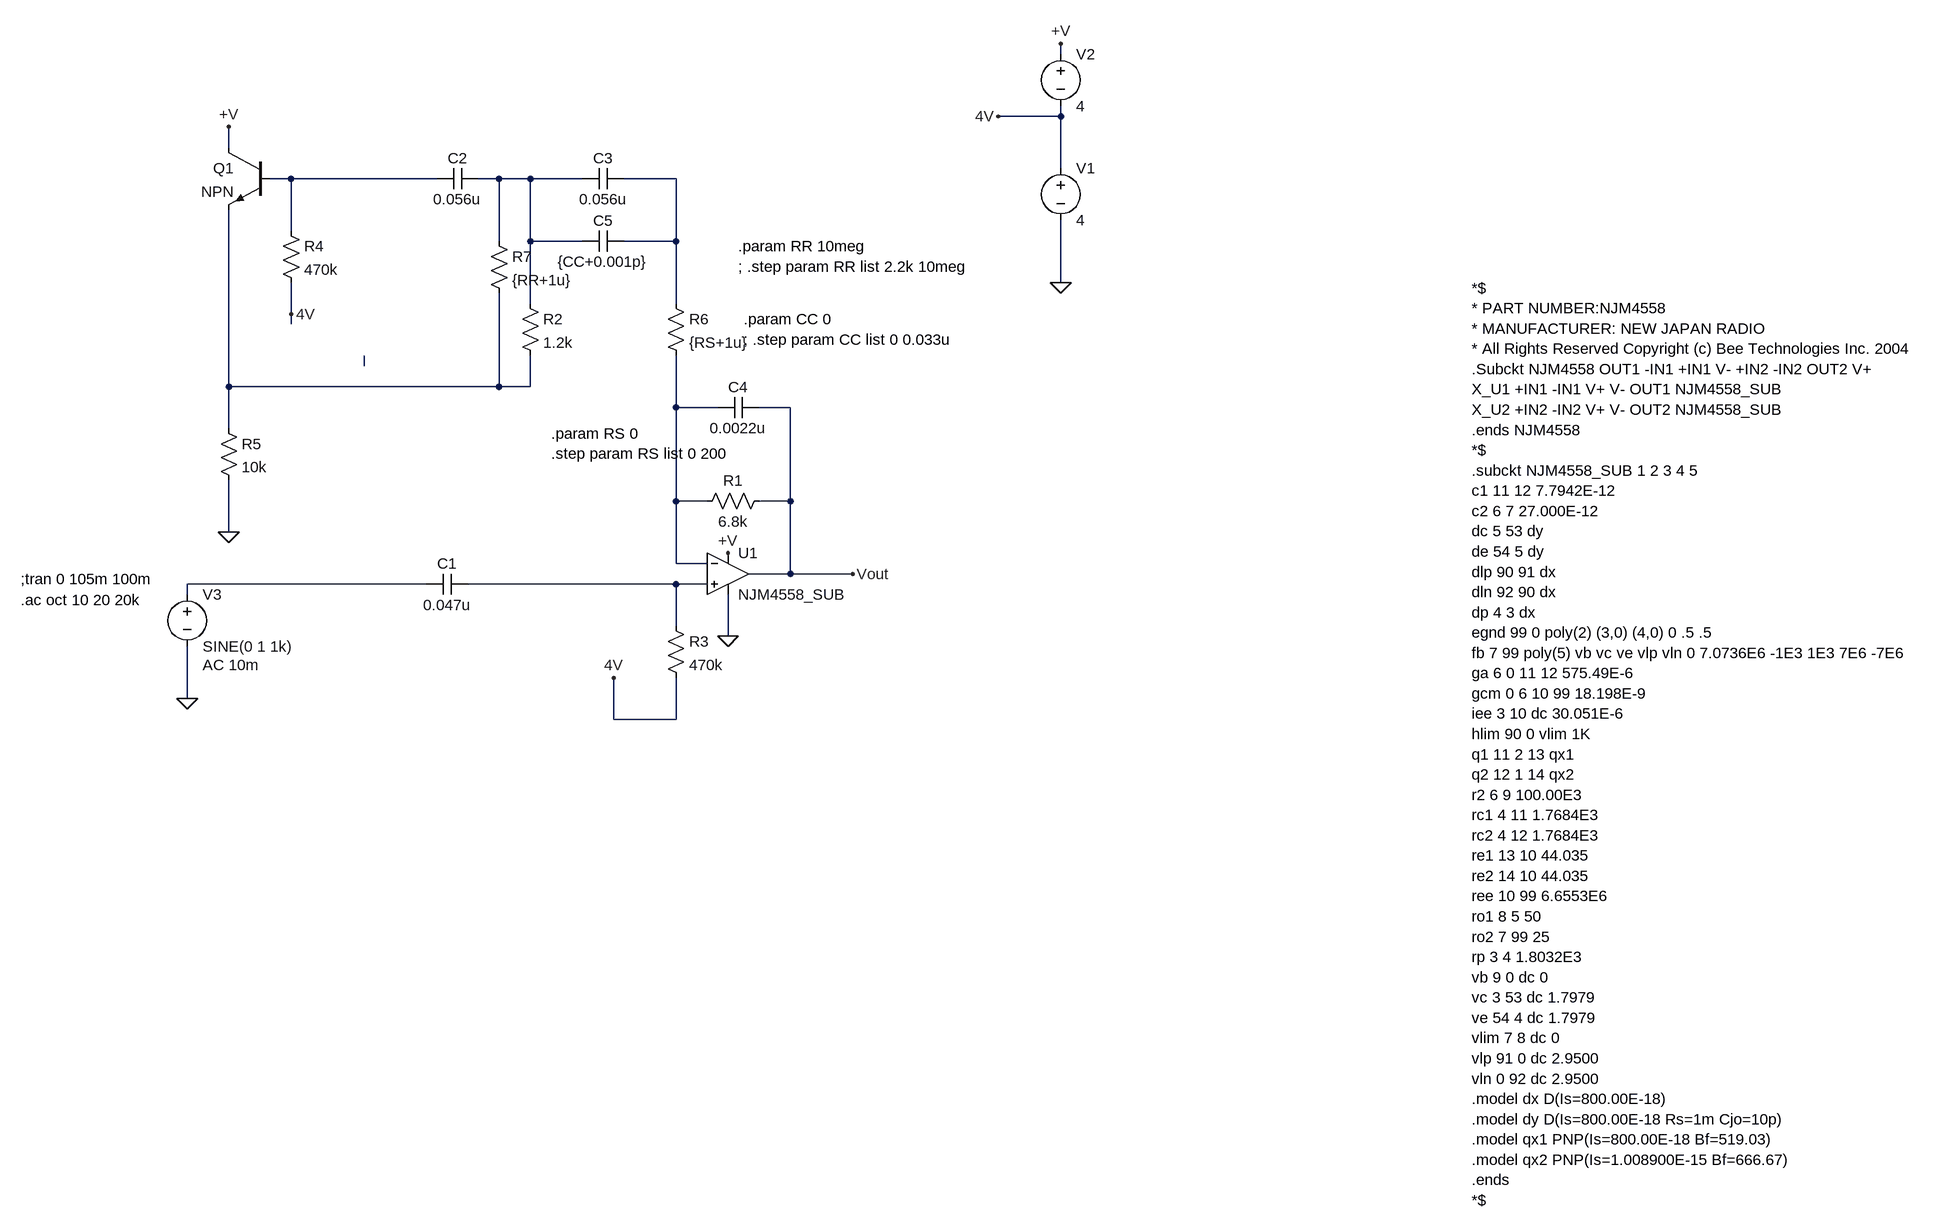
[diagram p0: schematic SimL_LowBoost.asc]
SimL_LowBoost.asc, the LTspice schematic file:
Version 4
SHEET 1 2008 1608
WIRE 560 -160 560 -176
WIRE 560 -64 560 -80
WIRE 560 -64 464 -64
WIRE -720 -16 -720 -48
WIRE 560 16 560 -64
WIRE -624 32 -656 32
WIRE -400 32 -624 32
WIRE -304 32 -336 32
WIRE -256 32 -304 32
WIRE -176 32 -256 32
WIRE -32 32 -112 32
WIRE -624 112 -624 32
WIRE -304 128 -304 32
WIRE -256 128 -256 32
WIRE -176 128 -256 128
WIRE -32 128 -32 32
WIRE -32 128 -112 128
WIRE 560 192 560 96
WIRE -256 224 -256 128
WIRE -32 224 -32 128
WIRE -624 240 -624 192
WIRE -624 256 -624 240
WIRE -512 320 -512 304
WIRE -720 352 -720 80
WIRE -304 352 -304 208
WIRE -304 352 -720 352
WIRE -256 352 -256 304
WIRE -256 352 -304 352
WIRE -32 384 -32 304
WIRE 32 384 -32 384
WIRE 144 384 96 384
WIRE -720 416 -720 352
WIRE -32 528 -32 384
WIRE 16 528 -32 528
WIRE 144 528 144 384
WIRE 144 528 96 528
WIRE -720 576 -720 496
WIRE -32 624 -32 528
WIRE 16 624 -32 624
WIRE 144 640 144 528
WIRE 144 640 80 640
WIRE 240 640 144 640
WIRE -416 656 -784 656
WIRE -32 656 -352 656
WIRE 16 656 -32 656
WIRE -784 672 -784 656
WIRE -32 720 -32 656
WIRE 48 736 48 672
WIRE -784 832 -784 752
WIRE -128 864 -128 800
WIRE -32 864 -32 800
WIRE -32 864 -128 864
FLAG -784 832 0
FLAG 560 192 0
FLAG 560 -176 +V
FLAG 48 608 +V
FLAG 464 -64 4V
FLAG -128 800 4V
FLAG -720 576 0
FLAG -720 -48 +V
FLAG 240 640 Vout
FLAG -624 240 4V
FLAG 48 736 0
SYMBOL Opamps\\opamp2 48 576 R0
SYMATTR InstName U1
SYMATTR Value NJM4558_SUB
SYMBOL voltage 560 0 R0
WINDOW 123 0 0 Left 2
WINDOW 39 0 0 Left 2
SYMATTR InstName V1
SYMATTR Value 4
SYMBOL voltage 560 -176 R0
WINDOW 123 0 0 Left 2
WINDOW 39 0 0 Left 2
SYMATTR InstName V2
SYMATTR Value 4
SYMBOL voltage -784 656 R0
WINDOW 123 24 124 Left 2
WINDOW 39 0 0 Left 2
SYMATTR Value2 AC 10m
SYMATTR InstName V3
SYMATTR Value SINE(0 1 1k)
SYMBOL res 112 512 R90
WINDOW 0 0 56 VBottom 2
WINDOW 3 32 56 VTop 2
SYMATTR InstName R1
SYMATTR Value 6.8k
SYMBOL cap -352 640 R90
WINDOW 0 0 32 VBottom 2
WINDOW 3 32 32 VTop 2
SYMATTR InstName C1
SYMATTR Value 0.047u
SYMBOL res -48 704 R0
SYMATTR InstName R3
SYMATTR Value 470k
SYMBOL npn -656 -16 M0
SYMATTR InstName Q1
SYMBOL cap -336 16 R90
WINDOW 0 0 32 VBottom 2
WINDOW 3 32 32 VTop 2
SYMATTR InstName C2
SYMATTR Value 0.056u
SYMBOL res -272 208 R0
SYMATTR InstName R2
SYMATTR Value 1.2k
SYMBOL res -640 96 R0
SYMATTR InstName R4
SYMATTR Value 470k
SYMBOL res -736 400 R0
SYMATTR InstName R5
SYMATTR Value 10k
SYMBOL cap 96 368 R90
WINDOW 0 0 32 VBottom 2
WINDOW 3 32 32 VTop 2
SYMATTR InstName C4
SYMATTR Value 0.0022u
SYMBOL cap -112 16 R90
WINDOW 0 0 32 VBottom 2
WINDOW 3 32 32 VTop 2
SYMATTR InstName C3
SYMATTR Value 0.056u
SYMBOL res -320 112 R0
SYMATTR InstName R7
SYMATTR Value {RR+1u}
SYMBOL cap -112 112 R90
WINDOW 0 0 32 VBottom 2
WINDOW 3 32 32 VTop 2
SYMATTR InstName C5
SYMATTR Value {CC+0.001p}
SYMBOL res -48 208 R0
SYMATTR InstName R6
SYMATTR Value {RS+1u}
TEXT 1192 200 Left 2 !*$\n* PART NUMBER:NJM4558\n* MANUFACTURER: NEW JAPAN RADIO\n* All Rights Reserved Copyright (c) Bee Technologies Inc. 2004\n.Subckt NJM4558 OUT1 -IN1 +IN1 V- +IN2 -IN2 OUT2 V+\nX_U1 +IN1 -IN1 V+ V- OUT1 NJM4558_SUB\nX_U2 +IN2 -IN2 V+ V- OUT2 NJM4558_SUB\n.ends NJM4558\n*$\n.subckt NJM4558_SUB 1 2 3 4 5\nc1 11 12 7.7942E-12\nc2 6 7 27.000E-12\ndc 5 53 dy\nde 54 5 dy\ndlp 90 91 dx\ndln 92 90 dx\ndp 4 3 dx\negnd 99 0 poly(2) (3,0) (4,0) 0 .5 .5\nfb 7 99 poly(5) vb vc ve vlp vln 0 7.0736E6 -1E3 1E3 7E6 -7E6\nga 6 0 11 12 575.49E-6\ngcm 0 6 10 99 18.198E-9\niee 3 10 dc 30.051E-6\nhlim 90 0 vlim 1K\nq1 11 2 13 qx1\nq2 12 1 14 qx2\nr2 6 9 100.00E3\nrc1 4 11 1.7684E3\nrc2 4 12 1.7684E3\nre1 13 10 44.035\nre2 14 10 44.035\nree 10 99 6.6553E6\nro1 8 5 50\nro2 7 99 25\nrp 3 4 1.8032E3\nvb 9 0 dc 0\nvc 3 53 dc 1.7979\nve 54 4 dc 1.7979\nvlim 7 8 dc 0\nvlp 91 0 dc 2.9500\nvln 0 92 dc 2.9500\n.model dx D(Is=800.00E-18)\n.model dy D(Is=800.00E-18 Rs=1m Cjo=10p)\n.model qx1 PNP(Is=800.00E-18 Bf=519.03)\n.model qx2 PNP(Is=1.008900E-15 Bf=666.67)\n.ends\n*$
TEXT -1040 680 Left 2 !.ac oct 10 20 20k
TEXT -1040 648 Left 2 !;tran 0 105m 100m
TEXT 64 136 Left 2 !.param RR 10meg\n; .step param RR list 2.2k 10meg
TEXT 72 248 Left 2 !.param CC 0\n; .step param CC list 0 0.033u
TEXT -224 424 Left 2 !.param RS 0\n.step param RS list 0 200

The netlist it stands for:
* SimL_LowBoost.asc
XU1 N008 N006 +V 0 Vout NJM4558_SUB  ; pins In+ In- V+ V- OUT
V1 4V 0 4
V2 +V 4V 4
V3 N007 0 SINE(0 1 1k) AC 10m
R1 Vout N006 6.8k
C1 N008 N007 0.047u
R3 N008 4V 470k
Q1 +V N001 N005 0 NPN
C2 N002 N001 0.056u
R2 N002 N005 1.2k
R4 N001 4V 470k
R5 N005 0 10k
C4 Vout N006 0.0022u
C3 N003 N002 0.056u
R7 N002 N005 {RR+1u}
C5 N003 N002 {CC+0.001p}
R6 N003 N006 {RS+1u}
.model NPN NPN
.model PNP PNP
.lib standard.bjt
*$
* PART NUMBER:NJM4558
* MANUFACTURER: NEW JAPAN RADIO
* All Rights Reserved Copyright (c) Bee Technologies Inc. 2004
.Subckt NJM4558 OUT1 -IN1 +IN1 V- +IN2 -IN2 OUT2 V+
X_U1 +IN1 -IN1 V+ V- OUT1 NJM4558_SUB
X_U2 +IN2 -IN2 V+ V- OUT2 NJM4558_SUB
.ends NJM4558
*$
.subckt NJM4558_SUB 1 2 3 4 5
c1 11 12 7.7942E-12
c2 6 7 27.000E-12
dc 5 53 dy
de 54 5 dy
dlp 90 91 dx
dln 92 90 dx
dp 4 3 dx
egnd 99 0 poly(2) (3,0) (4,0) 0 .5 .5
fb 7 99 poly(5) vb vc ve vlp vln 0 7.0736E6 -1E3 1E3 7E6 -7E6
ga 6 0 11 12 575.49E-6
gcm 0 6 10 99 18.198E-9
iee 3 10 dc 30.051E-6
hlim 90 0 vlim 1K
q1 11 2 13 qx1
q2 12 1 14 qx2
r2 6 9 100.00E3
rc1 4 11 1.7684E3
rc2 4 12 1.7684E3
re1 13 10 44.035
re2 14 10 44.035
ree 10 99 6.6553E6
ro1 8 5 50
ro2 7 99 25
rp 3 4 1.8032E3
vb 9 0 dc 0
vc 3 53 dc 1.7979
ve 54 4 dc 1.7979
vlim 7 8 dc 0
vlp 91 0 dc 2.9500
vln 0 92 dc 2.9500
.model dx D(Is=800.00E-18)
.model dy D(Is=800.00E-18 Rs=1m Cjo=10p)
.model qx1 PNP(Is=800.00E-18 Bf=519.03)
.model qx2 PNP(Is=1.008900E-15 Bf=666.67)
.ends
*$
.ac oct 10 20 20k
;tran 0 105m 100m
.param RR 10meg
; .step param RR list 2.2k 10meg
.param CC 0
; .step param CC list 0 0.033u
.param RS 0
.step param RS list 0 200
.backanno
.end